# Altium schematic sheet Dream_96.SchDoc
size A3
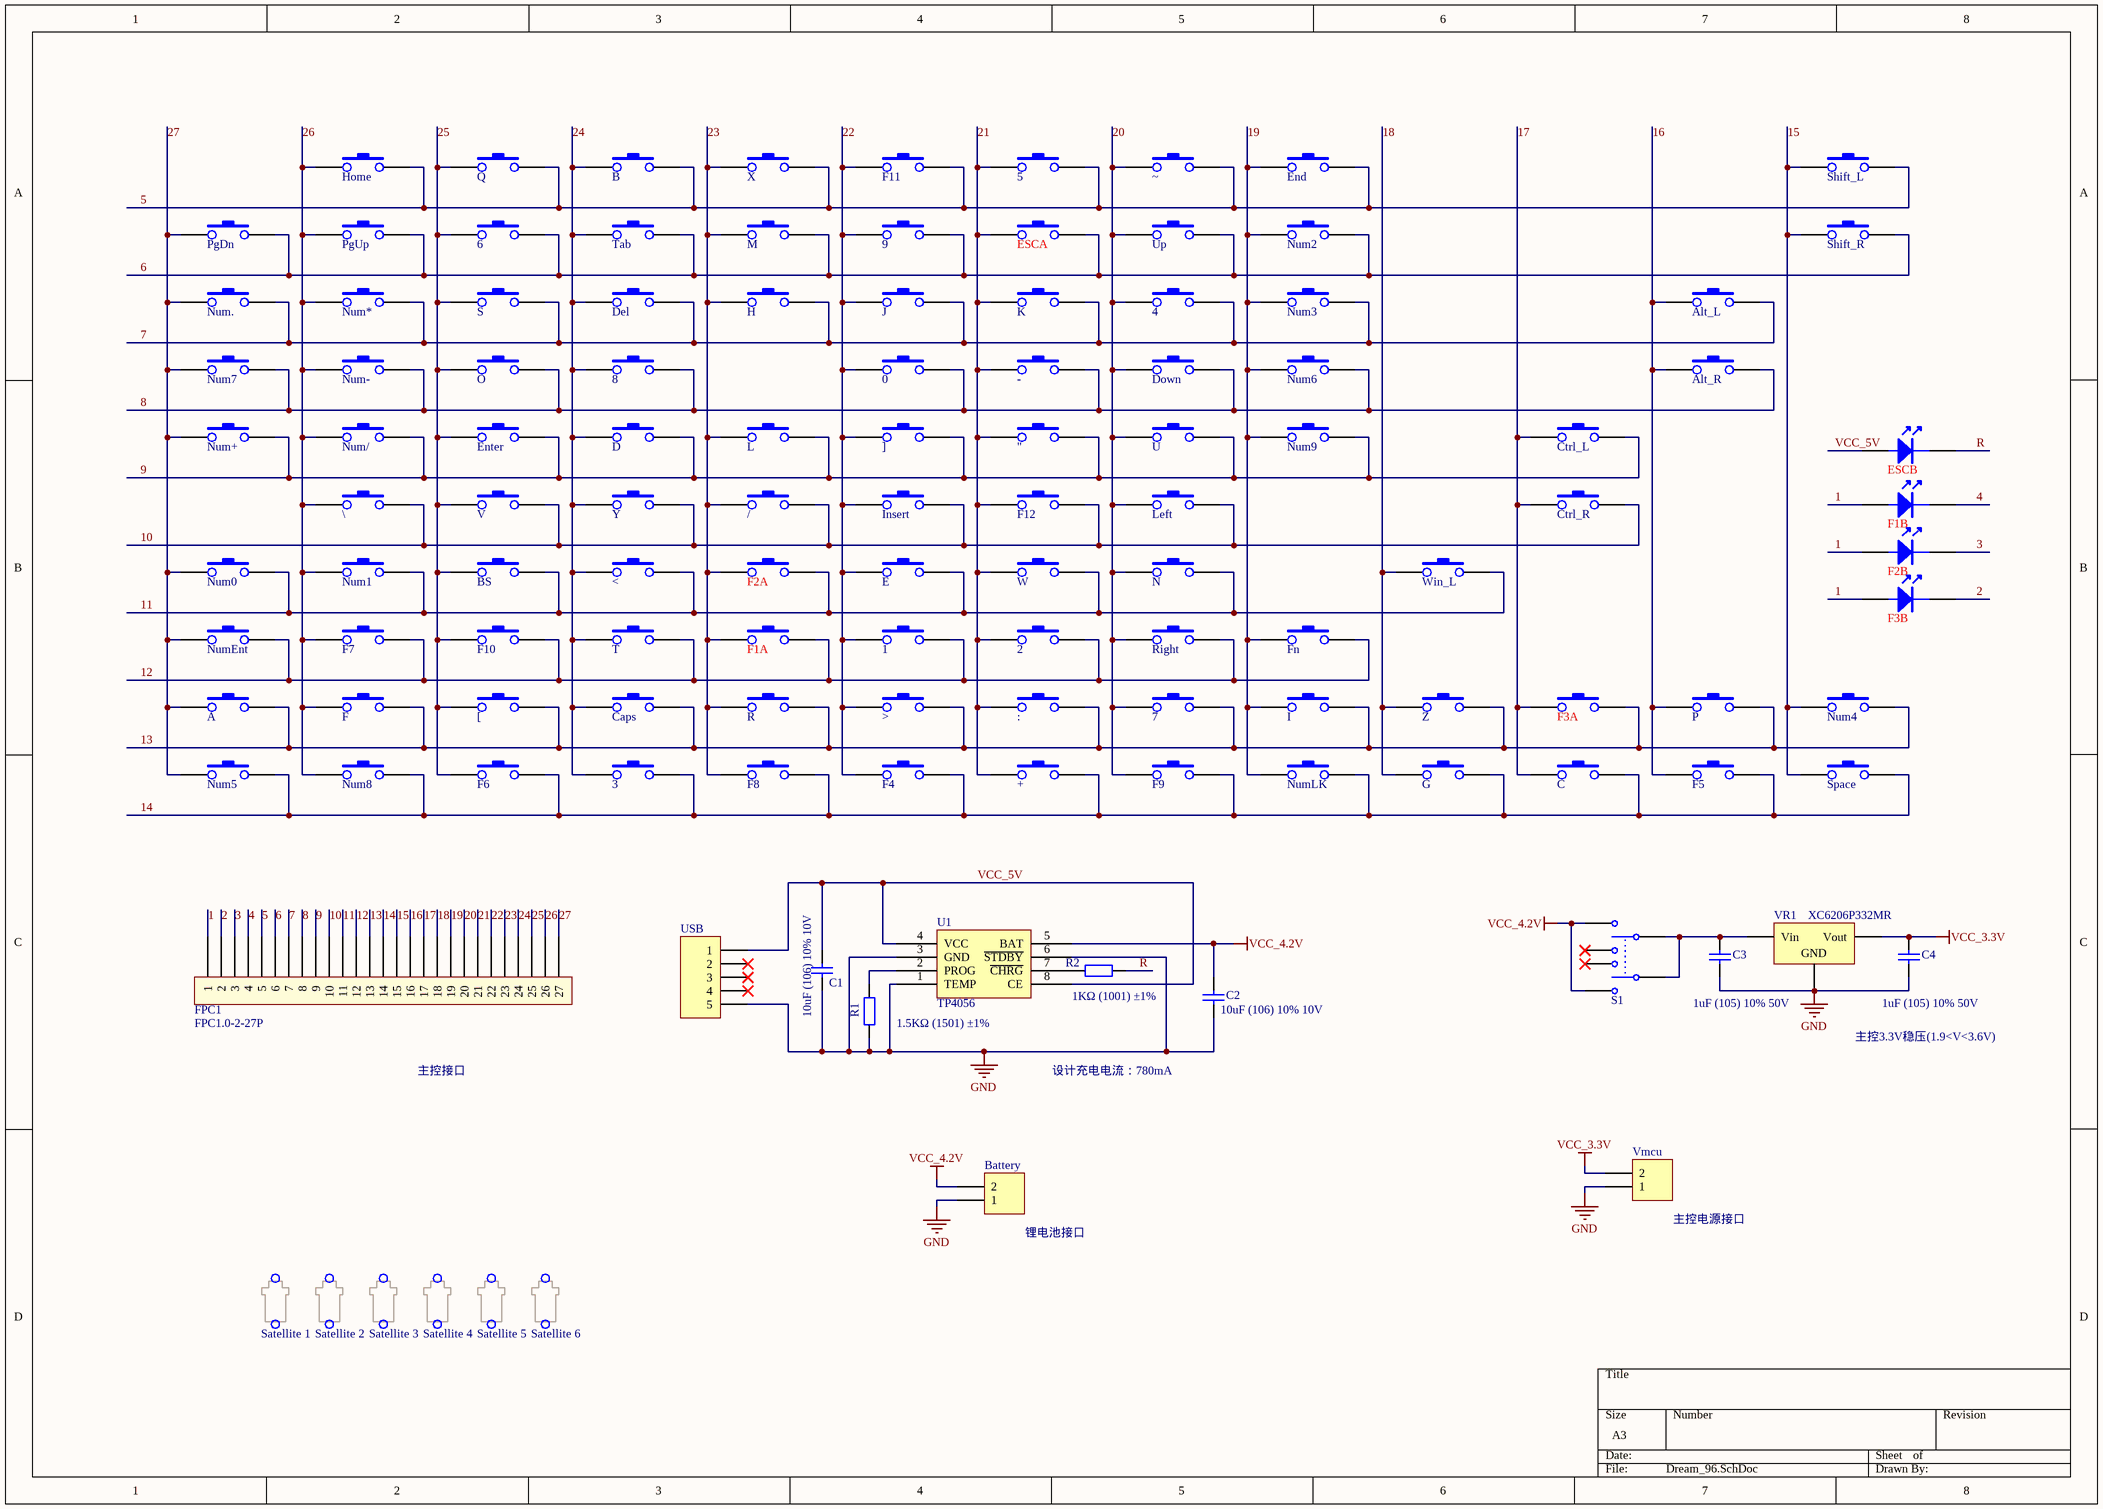
[diagram p0: Dream_96.SchDoc]

## Parts
0  Cherry  Mx  [MX]  (value not drawn)
1  Cherry  Mx  [MX]  (value not drawn)
2  Cherry  Mx  [MX]  (value not drawn)
3  Cherry  Mx  [MX]  (value not drawn)
4  Cherry  Mx  [MX]  (value not drawn)
5  Cherry  Mx  [MX]  (value not drawn)
6  Cherry  Mx  [MX]  (value not drawn)
7  Cherry  Mx  [MX]  (value not drawn)
8  Cherry  Mx  [MX]  (value not drawn)
9  Cherry  Mx  [MX]  (value not drawn)
"  Cherry  Mx  [MX]  (value not drawn)
+  Cherry  Mx  [MX]  (value not drawn)
-  Cherry  Mx  [MX]  (value not drawn)
/  Cherry  Mx  [MX]  (value not drawn)
:  Cherry  Mx  [MX]  (value not drawn)
<  Cherry  Mx  [MX]  (value not drawn)
>  Cherry  Mx  [MX]  (value not drawn)
[  Cherry  Mx  [MX]  (value not drawn)
\  Cherry  Mx  [MX]  (value not drawn)
]  Cherry  Mx  [MX]  (value not drawn)
A  Cherry  Mx  [MX]  (value not drawn)
Alt_L  Cherry  Mx  [MX]  (value not drawn)
Alt_R  Cherry  Mx  [MX]  (value not drawn)
B  Cherry  Mx  [MX]  (value not drawn)
Battery  MHDR1X2  [1.25T-1-2AW]  (value not drawn)
BS  Cherry  Mx  [MX]  (value not drawn)
C  Cherry  Mx  [MX]  (value not drawn)
C1  10uF (106) 10% 10V  [0603_C]
C2  10uF (106) 10% 10V  [0603_C]
C3  1uF (105) 10% 50V  [0603_C]
C4  1uF (105) 10% 50V  [0603_C]
Caps  Cherry  Mx  [MX]  (value not drawn)
Ctrl_L  Cherry  Mx  [MX]  (value not drawn)
Ctrl_R  Cherry  Mx  [MX]  (value not drawn)
D  Cherry  Mx  [MX]  (value not drawn)
Del  Cherry  Mx  [MX]  (value not drawn)
Down  Cherry  Mx  [MX]  (value not drawn)
E  Cherry  Mx  [MX]  (value not drawn)
End  Cherry  Mx  [MX]  (value not drawn)
Enter  Cherry  Mx  [MX]  (value not drawn)
ESC  Cherry  MX_LED  [MX_LED]  (value not drawn)  (parts A,B of 2)
F  Cherry  Mx  [MX]  (value not drawn)
F1  Cherry  MX_LED  [MX_LED]  (value not drawn)  (parts A,B of 2)
F2  Cherry  MX_LED  [MX_LED]  (value not drawn)  (parts A,B of 2)
F3  Cherry  MX_LED  [MX_LED]  (value not drawn)  (parts A,B of 2)
F4  Cherry  Mx  [MX]  (value not drawn)
F5  Cherry  Mx  [MX]  (value not drawn)
F6  Cherry  Mx  [MX]  (value not drawn)
F7  Cherry  Mx  [MX]  (value not drawn)
F8  Cherry  Mx  [MX]  (value not drawn)
F9  Cherry  Mx  [MX]  (value not drawn)
F10  Cherry  Mx  [MX]  (value not drawn)
F11  Cherry  Mx  [MX]  (value not drawn)
F12  Cherry  Mx  [MX]  (value not drawn)
Fn  Cherry  Mx  [MX]  (value not drawn)
FPC1  FPC1.0-2-27P  [FPC1.0-2-27P]
G  Cherry  Mx  [MX]  (value not drawn)
H  Cherry  Mx  [MX]  (value not drawn)
Home  Cherry  Mx  [MX]  (value not drawn)
I  Cherry  Mx  [MX]  (value not drawn)
Insert  Cherry  Mx  [MX]  (value not drawn)
J  Cherry  Mx  [MX]  (value not drawn)
K  Cherry  Mx  [MX]  (value not drawn)
L  Cherry  Mx  [MX]  (value not drawn)
Left  Cherry  Mx  [MX]  (value not drawn)
M  Cherry  Mx  [MX]  (value not drawn)
N  Cherry  Mx  [MX]  (value not drawn)
Num0  Cherry  Mx  [MX]  (value not drawn)
Num1  Cherry  Mx  [MX]  (value not drawn)
Num2  Cherry  Mx  [MX]  (value not drawn)
Num3  Cherry  Mx  [MX]  (value not drawn)
Num4  Cherry  Mx  [MX]  (value not drawn)
Num5  Cherry  Mx  [MX]  (value not drawn)
Num6  Cherry  Mx  [MX]  (value not drawn)
Num7  Cherry  Mx  [MX]  (value not drawn)
Num8  Cherry  Mx  [MX]  (value not drawn)
Num9  Cherry  Mx  [MX]  (value not drawn)
Num*  Cherry  Mx  [MX]  (value not drawn)
Num+  Cherry  Mx  [MX]  (value not drawn)
Num-  Cherry  Mx  [MX]  (value not drawn)
Num.  Cherry  Mx  [MX]  (value not drawn)
Num/  Cherry  Mx  [MX]  (value not drawn)
NumEnt  Cherry  Mx  [MX]  (value not drawn)
NumLK  Cherry  Mx  [MX]  (value not drawn)
O  Cherry  Mx  [MX]  (value not drawn)
P  Cherry  Mx  [MX]  (value not drawn)
PgDn  Cherry  Mx  [MX]  (value not drawn)
PgUp  Cherry  Mx  [MX]  (value not drawn)
Q  Cherry  Mx  [MX]  (value not drawn)
R  Cherry  Mx  [MX]  (value not drawn)
R1  1.5KΩ (1501) ±1%  [0603_R]
R2  1KΩ (1001) ±1%  [0603_R]
Right  Cherry  Mx  [MX]  (value not drawn)
S  Cherry  Mx  [MX]  (value not drawn)
S1  SW_2P2T  [MSS22D18G2]  (value not drawn)
Satellite_1  Satellite 1x2  [Satellite 1x2]  (value not drawn)
Satellite_2  Satellite 1x2  [Satellite 1x2]  (value not drawn)
Satellite_3  Satellite 1x2  [Satellite 1x2]  (value not drawn)
Satellite_4  Satellite 1x2  [Satellite 1x2]  (value not drawn)
Satellite_5  Satellite 1x2  [Satellite 1x2]  (value not drawn)
Satellite_6  Satellite 1x2  [Satellite 1x6.25]  (value not drawn)
Shift_L  Cherry  Mx  [MX]  (value not drawn)
Shift_R  Cherry  Mx  [MX]  (value not drawn)
Space  Cherry  Mx  [MX]  (value not drawn)
T  Cherry  Mx  [MX]  (value not drawn)
Tab  Cherry  Mx  [MX]  (value not drawn)
U  Cherry  Mx  [MX]  (value not drawn)
U1  TP4056  [SOP-8_EP_150mil]
Up  Cherry  Mx  [MX]  (value not drawn)
USB  (no value)  [USB-Mini2]
V  Cherry  Mx  [MX]  (value not drawn)
Vmcu  MHDR1X2  [1.25T-1-2AW]  (value not drawn)
VR1  XC6206P332MR  [SOT-23-3L]
W  Cherry  Mx  [MX]  (value not drawn)
Win_L  Cherry  Mx  [MX]  (value not drawn)
X  Cherry  Mx  [MX]  (value not drawn)
Y  Cherry  Mx  [MX]  (value not drawn)
Z  Cherry  Mx  [MX]  (value not drawn)
~  Cherry  Mx  [MX]  (value not drawn)

## Nets
GND: Battery.1 C1.1 C2.1 C3.2 C4.2 R1.1 U1.1(TEMP) U1.3(GND) U1.6(~{STDBY}) USB.5 Vmcu.1 VR1.1(GND)
VCC_3.3V: C4.1 Vmcu.2 VR1.2(Vout)
VCC_4.2V: Battery.2 C2.2 S1.1 S1.6 U1.5(BAT)
1: F1.3(VCC) F2.3(VCC) F3.3(VCC) FPC1.1
2: F3.4(GND) FPC1.2
3: F2.4(GND) FPC1.3
4: F1.4(GND) FPC1.4
5: 5.2 B.2 End.2 F11.2 FPC1.5 Home.2 Q.1 Shift_L.2 X.2 ~.2
6: 6.2 9.1 ESC.2 FPC1.6 M.2 Num2.2 PgDn.2 PgUp.2 Shift_R.2 Tab.2 Up.2
7: 4.2 Alt_L.2 Del.2 FPC1.7 H.2 J.2 K.1 Num3.2 Num*.2 Num..2 S.2
8: 0.1 8.2 -.2 Alt_R.2 Down.2 FPC1.8 Num6.2 Num7.1 Num-.2 O.2
9: ".1 ].2 Ctrl_L.1 D.2 Enter.1 FPC1.9 L.1 Num9.2 Num+.1 Num/.2 U.2
10: /.2 \.2 Ctrl_R.1 F12.2 FPC1.10 Insert.2 Left.2 V.2 Y.2
11: <.2 BS.2 E.2 F2.2 FPC1.11 N.1 Num0.2 Num1.1 W.2 Win_L.1
12: 1.2 2.2 F1.2 F7.2 F10.2 Fn.2 FPC1.12 NumEnt.1 Right.2 T.2
13: 7.2 :.1 >.2 [.2 A.2 Caps.2 F.1 F3.1 FPC1.13 I.2 Num4.1 P.2 R.2 Z.1
14: 3.2 +.2 C.2 F4.2 F5.2 F6.2 F8.1 F9.1 FPC1.14 G.2 Num5.2 Num8.2 NumLK.2 Space.1
15: FPC1.15 Num4.2 Shift_L.1 Shift_R.1 Space.2
16: Alt_L.1 Alt_R.1 F5.1 FPC1.16 P.1
17: C.1 Ctrl_L.2 Ctrl_R.2 F3.2 FPC1.17
18: FPC1.18 G.1 Win_L.2 Z.2
19: End.1 Fn.1 FPC1.19 I.1 Num2.1 Num3.1 Num6.1 Num9.1 NumLK.1
20: 4.1 7.1 Down.1 F9.2 FPC1.20 Left.1 N.2 Right.1 U.1 Up.1 ~.1
21: 2.1 5.1 ".2 +.1 -.1 :.2 ESC.1 F12.1 FPC1.21 K.2 W.1
22: 0.2 1.1 9.2 >.1 ].1 E.1 F4.1 F11.1 FPC1.22 Insert.1 J.1
23: /.1 F1.1 F2.1 F8.2 FPC1.23 H.1 L.2 M.1 R.1 X.1
24: 3.1 8.1 <.1 B.1 Caps.1 D.1 Del.1 FPC1.24 T.1 Tab.1 Y.1
25: 6.1 [.1 BS.1 Enter.2 F6.1 F10.1 FPC1.25 O.1 Q.2 S.1 V.1
26: \.1 F.2 F7.1 FPC1.26 Home.1 Num1.2 Num8.1 Num*.1 Num-.1 Num/.1 PgUp.1
27: A.1 FPC1.27 Num0.1 Num5.1 Num7.2 Num+.2 Num..1 NumEnt.2 PgDn.1
R: ESC.4(GND) R2.1
VCC_5V: C1.2 ESC.3(VCC) U1.4(VCC) U1.8(CE) USB.1
NetC3_1: C3.1 S1.2 S1.5 VR1.3(Vin)
NetR1_2: R1.2 U1.2(PROG)
NetR2_2: R2.2 U1.7(~{CHRG})

Not connected (* = marked no-connect by the designer): S1 3* 4*; USB 2* 3* 4*

## Notes on the sheet
- 主控3.3V稳压(1.9<V<3.6V)
- 主控接口
- 设计充电电流：780mA
- (near Battery) 锂电池接口
- (near Vmcu) 主控电源接口

## Library data of the parts
0-9 " + - / : < > [ \ ] A Alt_L Alt_R B BS C Caps Ctrl_L Ctrl_R D Del Down E End Enter F F4-F12 Fn G H Home I Insert J K L Left M N Num0-Num9 Num* Num+ Num- Num. Num/ NumEnt NumLK O P PgDn PgUp Q R Right S Shift_L Shift_R Space T Tab U Up V W Win_L X Y Z ~ = MX
Battery Vmcu = MHDR1X2: Header, 2-Pin; LatestRevisionDate: 17-Jul-2002; LatestRevisionNote: Re-released for DXP Platform.; Publisher: Altium Limited
C1 C2 = 0603 10uF (106) 10% 10V: 贴片电容; ComponentLink1Description: 供应商链接; ComponentLink1URL: http://www.szlcsc.com/product/details_20411.html; Package: 0603; Supplier: LC; SuppliersPartNumber: C19702
C3 C4 = 0603 1uF (105) 10% 50V: 贴片电容; ComponentLink1Description: 供应商链接; ComponentLink1URL: http://www.szlcsc.com/product/details_16531.html; Package: 0603; Supplier: LC; SuppliersPartNumber: C15849
ESC F1-F3 = MX_LED: Cherry  Mx
R1 = 0603 1.5KΩ (1501) 1%: 贴片电阻; ComponentLink1Description: 供应商链接; ComponentLink1URL: http://www.szlcsc.com/product/details_23570.html; Package: 0603; Supplier: LC; SuppliersPartNumber: C22843
R2 = 0603 1KΩ (1001) 1%: 贴片电阻; ComponentLink1Description: 供应商链接; ComponentLink1URL: http://www.szlcsc.com/product/details_21904.html; Package: 0603; Supplier: LC; SuppliersPartNumber: C21190
S1 = SW_2P2T: Double-Pole, Double-Throw Switch
Satellite_1-Satellite_6 = Satellite
U1 = TP4056: 电池电源管理; ComponentLink1Description: 供应商链接; ComponentLink1URL: http://www.szlcsc.com/product/details_17264.html; Package: SOP-8_EP_150mil; Supplier: LC; SuppliersPartNumber: C16581
USB = Header 5: Header, 5-Pin; LatestRevisionDate: 17-Jul-2002; LatestRevisionNote: Re-released for DXP Platform.; Publisher: Altium Limited
VR1 = SOT-23 XC6206P332MR: 低压差线性稳压(LDO); ComponentLink1Description: 供应商链接; ComponentLink1URL: http://www.szlcsc.com/product/details_5896.html; Package: SOT-23; Supplier: LC; SuppliersPartNumber: C5446